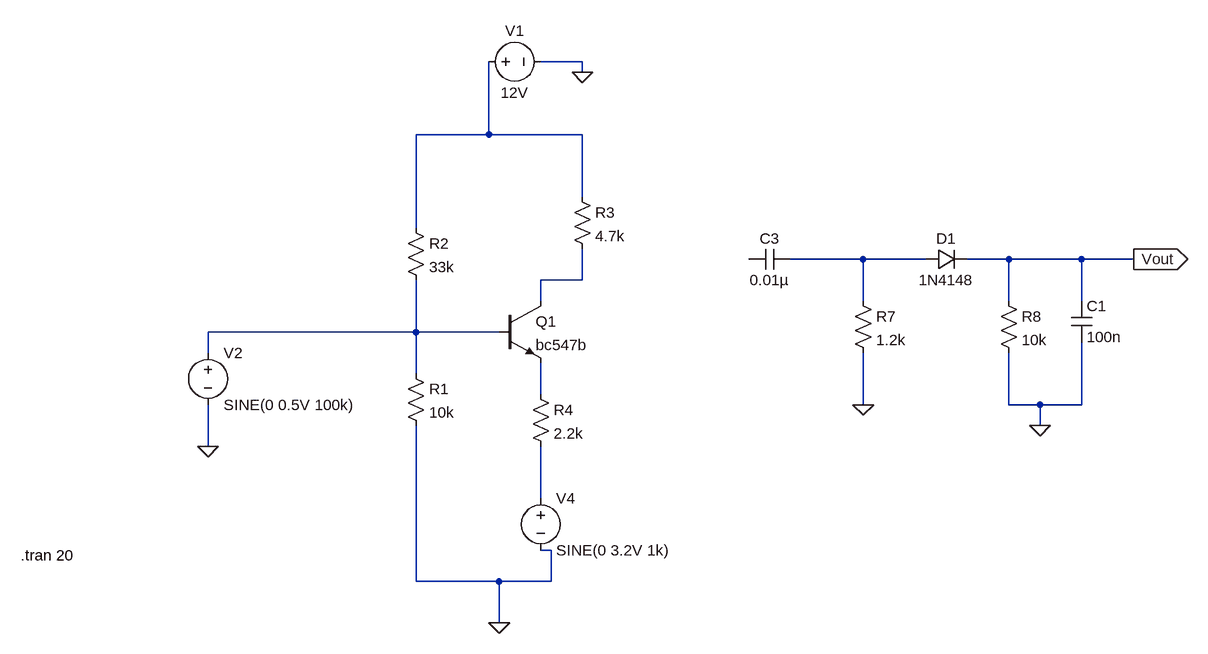
[diagram p0: schematic Draft4.asc]
Draft4.asc, the LTspice schematic file:
Version 4.1
SHEET 1 1264 680
WIRE 304 -272 240 -272
WIRE 304 -256 304 -272
WIRE 160 -160 160 -272
WIRE 160 -160 48 -160
WIRE 304 -160 160 -160
WIRE 304 -64 304 -160
WIRE 48 -16 48 -160
WIRE 576 32 560 32
WIRE 736 32 624 32
WIRE 832 32 736 32
WIRE 960 32 896 32
WIRE 1072 32 960 32
WIRE 1152 32 1072 32
WIRE 304 64 304 16
WIRE 304 64 240 64
WIRE 240 96 240 64
WIRE 736 96 736 32
WIRE 960 96 960 32
WIRE 1072 96 1072 32
WIRE 48 144 48 64
WIRE 48 144 -272 144
WIRE 176 144 48 144
WIRE -272 176 -272 144
WIRE 48 208 48 144
WIRE 240 240 240 192
WIRE 736 256 736 176
WIRE 960 256 960 176
WIRE 1008 256 960 256
WIRE 1072 256 1072 160
WIRE 1072 256 1008 256
WIRE 1008 288 1008 256
WIRE -272 320 -272 256
WIRE 240 400 240 320
WIRE 256 480 240 480
WIRE 48 528 48 288
WIRE 176 528 48 528
WIRE 256 528 256 480
WIRE 256 528 176 528
WIRE 176 592 176 528
FLAG 736 256 0
FLAG 1008 288 0
FLAG 176 592 0
FLAG 304 -256 0
FLAG -272 320 0
FLAG 1152 32 Vout
IOPIN 1152 32 Out
SYMBOL npn 176 96 R0
SYMATTR InstName Q1
SYMATTR Value bc547b
SYMBOL res 32 192 R0
SYMATTR InstName R1
SYMATTR Value 10k
SYMBOL res 32 -32 R0
SYMATTR InstName R2
SYMATTR Value 33k
SYMBOL res 288 -80 R0
SYMATTR InstName R3
SYMATTR Value 4.7k
SYMBOL res 224 224 R0
SYMATTR InstName R4
SYMATTR Value 2.2k
SYMBOL cap 624 16 R90
WINDOW 0 0 32 VBottom 2
WINDOW 3 32 32 VTop 2
SYMATTR InstName C3
SYMATTR Value 0.01µ
SYMBOL res 720 80 R0
SYMATTR InstName R7
SYMATTR Value 1.2k
SYMBOL res 944 80 R0
SYMATTR InstName R8
SYMATTR Value 10k
SYMBOL diode 832 48 R270
WINDOW 0 32 32 VTop 2
WINDOW 3 0 32 VBottom 2
SYMATTR InstName D1
SYMATTR Value 1N4148
SYMBOL cap 1056 96 R0
SYMATTR InstName C1
SYMATTR Value 100n
SYMBOL voltage 240 384 R0
WINDOW 123 0 0 Left 0
WINDOW 39 0 0 Left 0
SYMATTR InstName V4
SYMATTR Value SINE(0 3.2V 1k)
SYMBOL voltage 144 -272 R270
WINDOW 0 32 56 VTop 2
WINDOW 3 -32 56 VBottom 2
WINDOW 123 0 0 Left 0
WINDOW 39 0 0 Left 0
SYMATTR InstName V1
SYMATTR Value 12V
SYMBOL voltage -272 160 R0
WINDOW 123 0 0 Left 0
WINDOW 39 0 0 Left 0
SYMATTR InstName V2
SYMATTR Value SINE(0 0.5V 100k)
TEXT -560 488 Left 2 !.tran 20

The netlist it stands for:
* Draft4.asc
Q1 N004 N005 N006 0 bc547b
R1 N005 0 10k
R2 N001 N005 33k
R3 N001 N004 4.7k
R4 N006 N007 2.2k
C3 N003 N002 0.01µ
R7 N003 0 1.2k
R8 Vout 0 10k
D1 N003 Vout 1N4148
C1 Vout 0 100n
V4 N007 0 SINE(0 3.2V 1k)
V1 N001 0 12V
V2 N005 0 SINE(0 0.5V 100k)
.model D D
.lib standard.dio
.model NPN NPN
.model PNP PNP
.lib standard.bjt
.tran 20
.backanno
.end